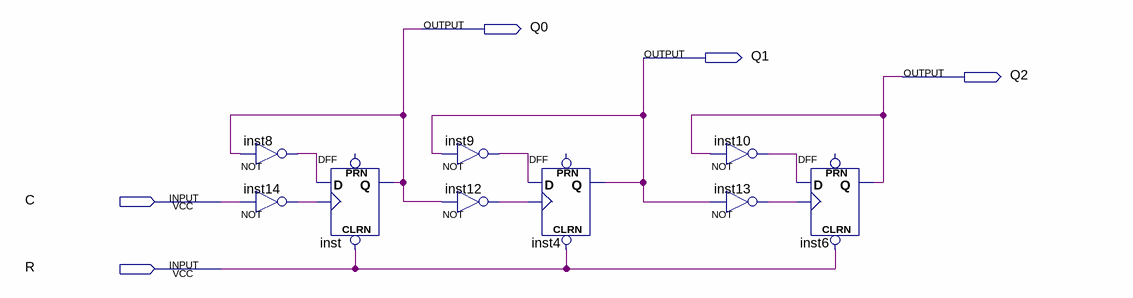
[diagram p0: schematic sheet]
// Quartus schematic CNT_without_R.bdf as structural Verilog: 9 symbols, 5 pins
module CNT_without_R (
  input  C,
  input  R,
  output Q0,
  output Q1,
  output Q2
);

  wire inst8_out, inst9_out, inst10_out, inst12_out, inst13_out, inst14_out;

  not inst8 (inst8_out, Q0);
  not inst14 (inst14_out, C);
  DFF inst (.CLRN(R), .CLK(inst14_out), .D(inst8_out), .Q(Q0));  // open: PRN
  not inst9 (inst9_out, Q1);
  not inst12 (inst12_out, Q0);
  DFF inst4 (.CLRN(R), .CLK(inst12_out), .D(inst9_out), .Q(Q1));  // open: PRN
  not inst10 (inst10_out, Q2);
  not inst13 (inst13_out, Q1);
  DFF inst6 (.CLRN(R), .CLK(inst13_out), .D(inst10_out), .Q(Q2));  // open: PRN
endmodule
